# EAGLE design MxxxOVR (EAGLE 6.6.0)

## Sheet 1 of 6
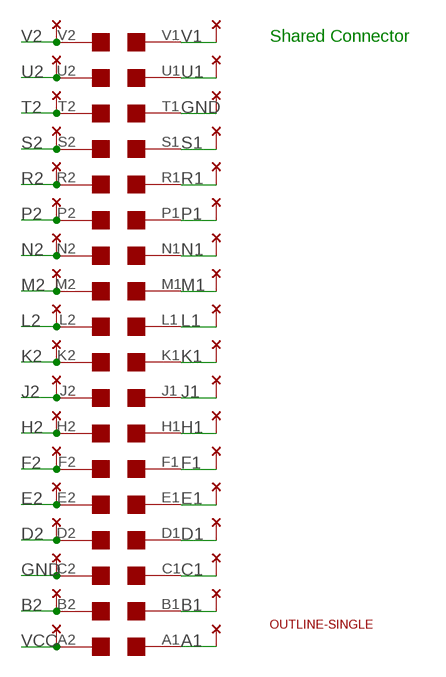
[diagram p0: schematic, sheet 1]

### Parts
U$1  EDGE-2CONNECTOR  [EDGE-CON2]
U$4  THRU-HOLE2A  [THRU-HOLEA]
U$5  OUTLINE-SINGLE  [SINGLE]

### Nets
A1: U$1.A1 U$4.A1 ; also sheet 2,3,4,5,6
B1: U$1.B1 U$4.B1 ; also sheet 2,3,4,5,6
B2: U$1.B2 U$4.B2
C1: U$1.C1 U$4.C1 ; also sheet 2,3,4,5,6
D1: U$1.D1 U$4.D1 ; also sheet 2,3,4,5,6
D2: U$1.D2 U$4.D2 ; also sheet 2,3,4,5,6
E1: U$1.E1 U$4.E1 ; also sheet 2,3,4,5
E2: U$1.E2 U$4.E2 ; also sheet 2,3,4,5,6
F1: U$1.F1 U$4.F1 ; also sheet 2,3,4,5,6
F2: U$1.F2 U$4.F2 ; also sheet 2,3,4,5,6
GND [Power]: U$1.C2 U$1.T1 U$4.C2 U$4.T1 ; also sheet 2,3,4,5,6
H1: U$1.H1 U$4.H1 ; also sheet 2,3,4,5,6
H2: U$1.H2 U$4.H2 ; also sheet 2,3,4,5,6
J1: U$1.J1 U$4.J1 ; also sheet 2,3,4,5,6
J2: U$1.J2 U$4.J2 ; also sheet 2,3,4,5,6
K1: U$1.K1 U$4.K1 ; also sheet 2,3,4,5,6
K2: U$1.K2 U$4.K2 ; also sheet 2,3,4,5,6
L1: U$1.L1 U$4.L1 ; also sheet 2,3,4,5
L2: U$1.L2 U$4.L2 ; also sheet 2,3,4,5,6
M1: U$1.M1 U$4.M1 ; also sheet 2,3,4,5,6
M2: U$1.M2 U$4.M2 ; also sheet 2,3,4,5,6
N1: U$1.N1 U$4.N1 ; also sheet 2,3,4,5,6
N2: U$1.N2 U$4.N2 ; also sheet 2,3,4,5,6
P1: U$1.P1 U$4.P1 ; also sheet 2,3,4,5,6
P2: U$1.P2 U$4.P2 ; also sheet 2,3,4,5,6
R1: U$1.R1 U$4.R1 ; also sheet 2,3,4,5,6
R2: U$1.R2 U$4.R2 ; also sheet 2,3,4,5,6
S1: U$1.S1 U$4.S1 ; also sheet 2,3,4,5
S2: U$1.S2 U$4.S2 ; also sheet 2,3,4,5,6
T2: U$1.T2 U$4.T2 ; also sheet 2,3,4,5,6
U1: U$1.U1 U$4.U1 ; also sheet 2,3,4
U2: U$1.U2 U$4.U2 ; also sheet 2,3,4,5,6
V1: U$1.V1 U$4.V1 ; also sheet 2,3,4
V2: U$1.V2 U$4.V2 ; also sheet 2,3,4,5,6
VCC [Power]: U$1.A2 U$4.A2 ; also sheet 2,3,4,5,6

### Notes on the sheet
- Shared Connector

## Sheet 2 of 6
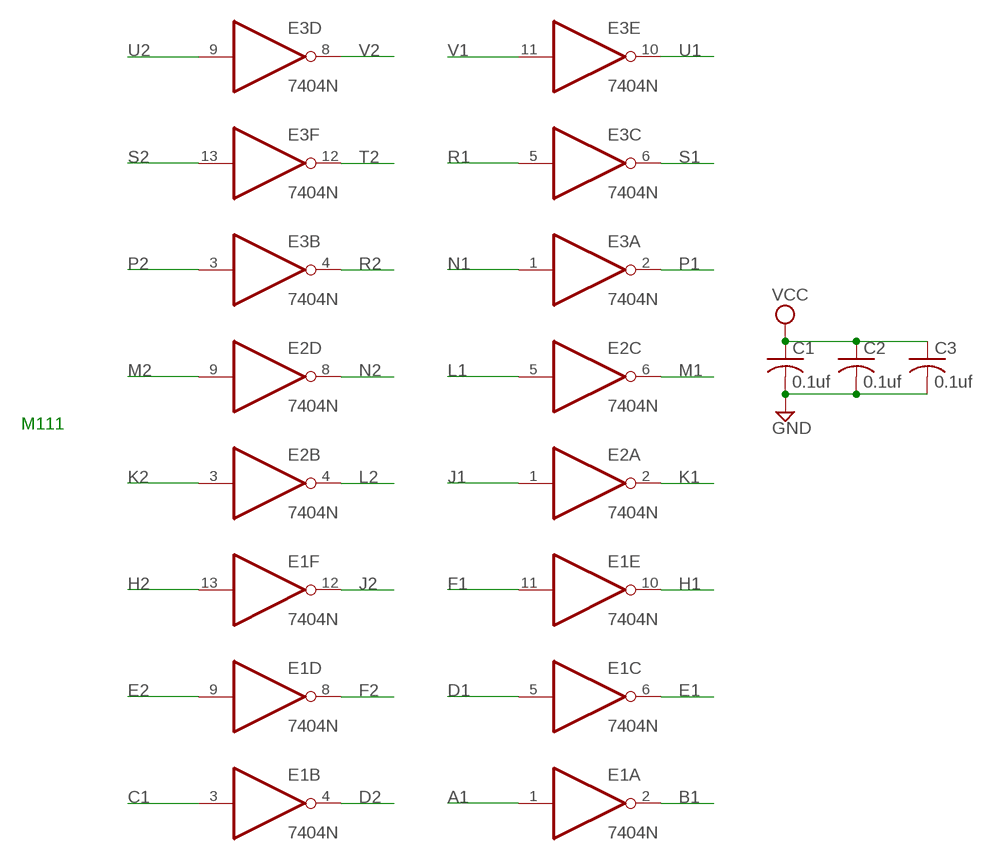
[diagram p1: schematic, sheet 2]

### Parts
C1  0.1uf  C-US050-025X075  [C050-025X075]
C2  0.1uf  C-US050-025X075  [C050-025X075]
C3  0.1uf  C-US050-025X075  [C050-025X075]
E1  7404N  [DIL14]
E2  7404N  [DIL14]
E3  7404N  [DIL14]

### Nets
A1: E1.1(A:I) ; also sheet 1,3,4,5,6
B1: E1.2(A:O) ; also sheet 1,3,4,5,6
C1: E1.3(B:I) ; also sheet 1,3,4,5,6
D1: E1.5(C:I) ; also sheet 1,3,4,5,6
D2: E1.4(B:O) ; also sheet 1,3,4,5,6
E1: E1.6(C:O) ; also sheet 1,3,4,5
E2: E1.9(D:I) ; also sheet 1,3,4,5,6
F1: E1.11(E:I) ; also sheet 1,3,4,5,6
F2: E1.8(D:O) ; also sheet 1,3,4,5,6
GND [Power]: C1.2 C2.2 C3.2 ; also sheet 1,3,4,5,6
H1: E1.10(E:O) ; also sheet 1,3,4,5,6
H2: E1.13(F:I) ; also sheet 1,3,4,5,6
J1: E2.1(A:I) ; also sheet 1,3,4,5,6
J2: E1.12(F:O) ; also sheet 1,3,4,5,6
K1: E2.2(A:O) ; also sheet 1,3,4,5,6
K2: E2.3(B:I) ; also sheet 1,3,4,5,6
L1: E2.5(C:I) ; also sheet 1,3,4,5
L2: E2.4(B:O) ; also sheet 1,3,4,5,6
M1: E2.6(C:O) ; also sheet 1,3,4,5,6
M2: E2.9(D:I) ; also sheet 1,3,4,5,6
N1: E3.1(A:I) ; also sheet 1,3,4,5,6
N2: E2.8(D:O) ; also sheet 1,3,4,5,6
P1: E3.2(A:O) ; also sheet 1,3,4,5,6
P2: E3.3(B:I) ; also sheet 1,3,4,5,6
R1: E3.5(C:I) ; also sheet 1,3,4,5,6
R2: E3.4(B:O) ; also sheet 1,3,4,5,6
S1: E3.6(C:O) ; also sheet 1,3,4,5
S2: E3.13(F:I) ; also sheet 1,3,4,5,6
T2: E3.12(F:O) ; also sheet 1,3,4,5,6
U1: E3.10(E:O) ; also sheet 1,3,4
U2: E3.9(D:I) ; also sheet 1,3,4,5,6
V1: E3.11(E:I) ; also sheet 1,3,4
V2: E3.8(D:O) ; also sheet 1,3,4,5,6
VCC [Power]: C1.1 C2.1 C3.1 ; also sheet 1,3,4,5,6
Unconnected: E2.10(E:O) E2.11(E:I) E2.12(F:O) E2.13(F:I)

### Notes on the sheet
- M111

## Sheet 3 of 6
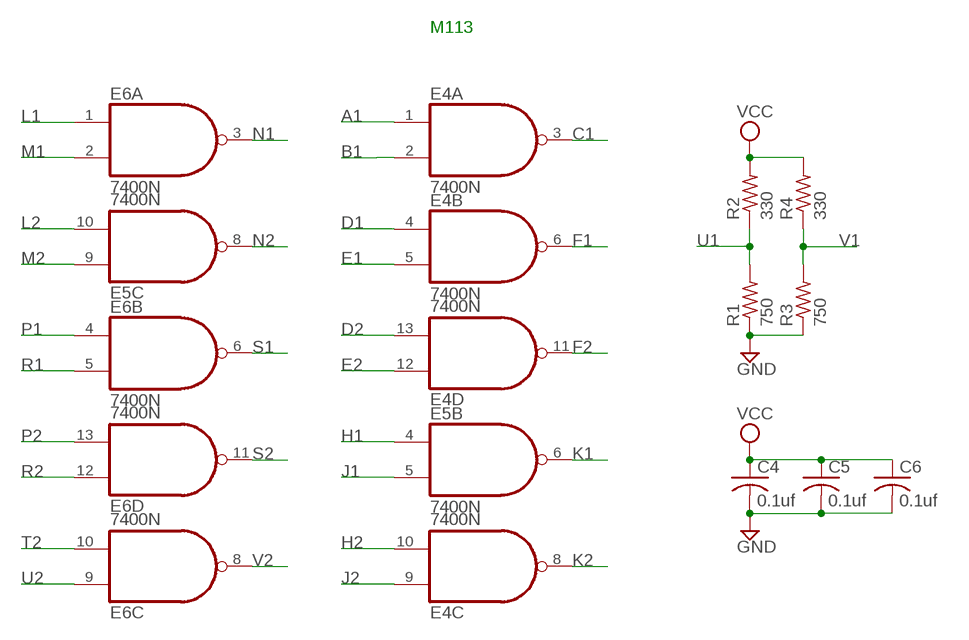
[diagram p2: schematic, sheet 3]

### Parts
C4  0.1uf  C-US050-025X075  [C050-025X075]
C5  0.1uf  C-US050-025X075  [C050-025X075]
C6  0.1uf  C-US050-025X075  [C050-025X075]
E4  7400N  [DIL14]
E5  7400N  [DIL14]
E6  7400N  [DIL14]
R1  750  R-US_0207/10  [0207/10]
R2  330  R-US_0207/10  [0207/10]
R3  750  R-US_0207/10  [0207/10]
R4  330  R-US_0207/10  [0207/10]

### Nets
A1: E4.1(A:I0) ; also sheet 1,2,4,5,6
B1: E4.2(A:I1) ; also sheet 1,2,4,5,6
C1: E4.3(A:O) ; also sheet 1,2,4,5,6
D1: E4.4(B:I0) ; also sheet 1,2,4,5,6
D2: E4.13(D:I1) ; also sheet 1,2,4,5,6
E1: E4.5(B:I1) ; also sheet 1,2,4,5
E2: E4.12(D:I0) ; also sheet 1,2,4,5,6
F1: E4.6(B:O) ; also sheet 1,2,4,5,6
F2: E4.11(D:O) ; also sheet 1,2,4,5,6
GND [Power]: C4.2 C5.2 C6.2 R1.1 R3.1 ; also sheet 1,2,4,5,6
H1: E5.4(B:I0) ; also sheet 1,2,4,5,6
H2: E4.10(C:I1) ; also sheet 1,2,4,5,6
J1: E5.5(B:I1) ; also sheet 1,2,4,5,6
J2: E4.9(C:I0) ; also sheet 1,2,4,5,6
K1: E5.6(B:O) ; also sheet 1,2,4,5,6
K2: E4.8(C:O) ; also sheet 1,2,4,5,6
L1: E6.1(A:I0) ; also sheet 1,2,4,5
L2: E5.10(C:I1) ; also sheet 1,2,4,5,6
M1: E6.2(A:I1) ; also sheet 1,2,4,5,6
M2: E5.9(C:I0) ; also sheet 1,2,4,5,6
N1: E6.3(A:O) ; also sheet 1,2,4,5,6
N2: E5.8(C:O) ; also sheet 1,2,4,5,6
P1: E6.4(B:I0) ; also sheet 1,2,4,5,6
P2: E6.13(D:I1) ; also sheet 1,2,4,5,6
R1: E6.5(B:I1) ; also sheet 1,2,4,5,6
R2: E6.12(D:I0) ; also sheet 1,2,4,5,6
S1: E6.6(B:O) ; also sheet 1,2,4,5
S2: E6.11(D:O) ; also sheet 1,2,4,5,6
T2: E6.10(C:I1) ; also sheet 1,2,4,5,6
U1: R1.2 R2.1 ; also sheet 1,2,4
U2: E6.9(C:I0) ; also sheet 1,2,4,5,6
V1: R3.2 R4.1 ; also sheet 1,2,4
V2: E6.8(C:O) ; also sheet 1,2,4,5,6
VCC [Power]: C4.1 C5.1 C6.1 R2.2 R4.2 ; also sheet 1,2,4,5,6
Unconnected: E5.1(A:I0) E5.2(A:I1) E5.3(A:O) E5.11(D:O) E5.12(D:I0) E5.13(D:I1)

### Notes on the sheet
- M113

## Sheet 4 of 6
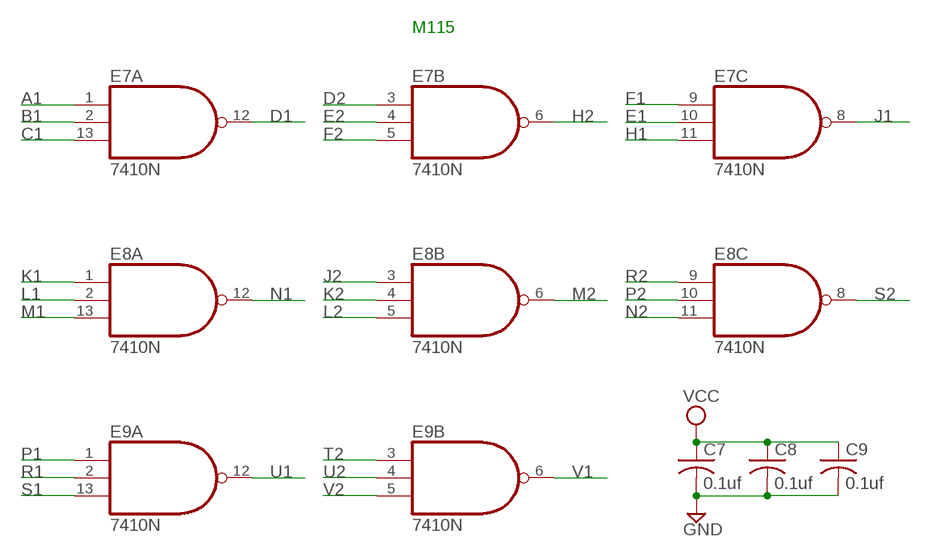
[diagram p3: schematic, sheet 4]

### Parts
C7  0.1uf  C-US050-025X075  [C050-025X075]
C8  0.1uf  C-US050-025X075  [C050-025X075]
C9  0.1uf  C-US050-025X075  [C050-025X075]
E7  7410N  [DIL14]
E8  7410N  [DIL14]
E9  7410N  [DIL14]

### Nets
A1: E7.1(A:I0) ; also sheet 1,2,3,5,6
B1: E7.2(A:I1) ; also sheet 1,2,3,5,6
C1: E7.13(A:I2) ; also sheet 1,2,3,5,6
D1: E7.12(A:O) ; also sheet 1,2,3,5,6
D2: E7.3(B:I0) ; also sheet 1,2,3,5,6
E1: E7.10(C:I1) ; also sheet 1,2,3,5
E2: E7.4(B:I1) ; also sheet 1,2,3,5,6
F1: E7.9(C:I0) ; also sheet 1,2,3,5,6
F2: E7.5(B:I2) ; also sheet 1,2,3,5,6
GND [Power]: C7.2 C8.2 C9.2 ; also sheet 1,2,3,5,6
H1: E7.11(C:I2) ; also sheet 1,2,3,5,6
H2: E7.6(B:O) ; also sheet 1,2,3,5,6
J1: E7.8(C:O) ; also sheet 1,2,3,5,6
J2: E8.3(B:I0) ; also sheet 1,2,3,5,6
K1: E8.1(A:I0) ; also sheet 1,2,3,5,6
K2: E8.4(B:I1) ; also sheet 1,2,3,5,6
L1: E8.2(A:I1) ; also sheet 1,2,3,5
L2: E8.5(B:I2) ; also sheet 1,2,3,5,6
M1: E8.13(A:I2) ; also sheet 1,2,3,5,6
M2: E8.6(B:O) ; also sheet 1,2,3,5,6
N1: E8.12(A:O) ; also sheet 1,2,3,5,6
N2: E8.11(C:I2) ; also sheet 1,2,3,5,6
P1: E9.1(A:I0) ; also sheet 1,2,3,5,6
P2: E8.10(C:I1) ; also sheet 1,2,3,5,6
R1: E9.2(A:I1) ; also sheet 1,2,3,5,6
R2: E8.9(C:I0) ; also sheet 1,2,3,5,6
S1: E9.13(A:I2) ; also sheet 1,2,3,5
S2: E8.8(C:O) ; also sheet 1,2,3,5,6
T2: E9.3(B:I0) ; also sheet 1,2,3,5,6
U1: E9.12(A:O) ; also sheet 1,2,3
U2: E9.4(B:I1) ; also sheet 1,2,3,5,6
V1: E9.6(B:O) ; also sheet 1,2,3
V2: E9.5(B:I2) ; also sheet 1,2,3,5,6
VCC [Power]: C7.1 C8.1 C9.1 ; also sheet 1,2,3,5,6
Unconnected: E9.8(C:O) E9.9(C:I0) E9.10(C:I1) E9.11(C:I2)

### Notes on the sheet
- M115

## Sheet 5 of 6
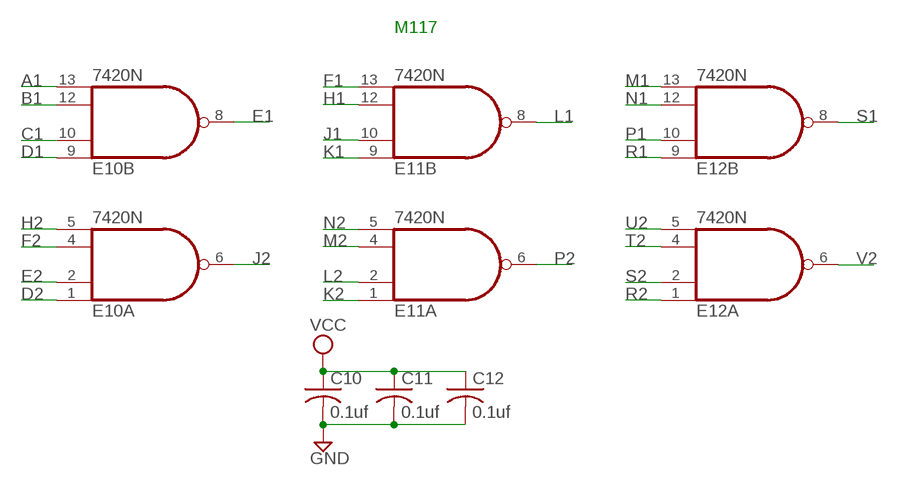
[diagram p4: schematic, sheet 5]

### Parts
C10  0.1uf  C-US050-025X075  [C050-025X075]
C11  0.1uf  C-US050-025X075  [C050-025X075]
C12  0.1uf  C-US050-025X075  [C050-025X075]
E10  7420N  74S20N  [DIL14]
E11  7420N  74S20N  [DIL14]
E12  7420N  74S20N  [DIL14]

### Nets
A1: E10.13(B:I3) ; also sheet 1,2,3,4,6
B1: E10.12(B:I2) ; also sheet 1,2,3,4,6
C1: E10.10(B:I1) ; also sheet 1,2,3,4,6
D1: E10.9(B:I0) ; also sheet 1,2,3,4,6
D2: E10.1(A:I0) ; also sheet 1,2,3,4,6
E1: E10.8(B:O) ; also sheet 1,2,3,4
E2: E10.2(A:I1) ; also sheet 1,2,3,4,6
F1: E11.13(B:I3) ; also sheet 1,2,3,4,6
F2: E10.4(A:I2) ; also sheet 1,2,3,4,6
GND [Power]: C10.2 C11.2 C12.2 ; also sheet 1,2,3,4,6
H1: E11.12(B:I2) ; also sheet 1,2,3,4,6
H2: E10.5(A:I3) ; also sheet 1,2,3,4,6
J1: E11.10(B:I1) ; also sheet 1,2,3,4,6
J2: E10.6(A:O) ; also sheet 1,2,3,4,6
K1: E11.9(B:I0) ; also sheet 1,2,3,4,6
K2: E11.1(A:I0) ; also sheet 1,2,3,4,6
L1: E11.8(B:O) ; also sheet 1,2,3,4
L2: E11.2(A:I1) ; also sheet 1,2,3,4,6
M1: E12.13(B:I3) ; also sheet 1,2,3,4,6
M2: E11.4(A:I2) ; also sheet 1,2,3,4,6
N1: E12.12(B:I2) ; also sheet 1,2,3,4,6
N2: E11.5(A:I3) ; also sheet 1,2,3,4,6
P1: E12.10(B:I1) ; also sheet 1,2,3,4,6
P2: E11.6(A:O) ; also sheet 1,2,3,4,6
R1: E12.9(B:I0) ; also sheet 1,2,3,4,6
R2: E12.1(A:I0) ; also sheet 1,2,3,4,6
S1: E12.8(B:O) ; also sheet 1,2,3,4
S2: E12.2(A:I1) ; also sheet 1,2,3,4,6
T2: E12.4(A:I2) ; also sheet 1,2,3,4,6
U2: E12.5(A:I3) ; also sheet 1,2,3,4,6
V2: E12.6(A:O) ; also sheet 1,2,3,4,6
VCC [Power]: C10.1 C11.1 C12.1 ; also sheet 1,2,3,4,6

### Notes on the sheet
- M117

## Sheet 6 of 6
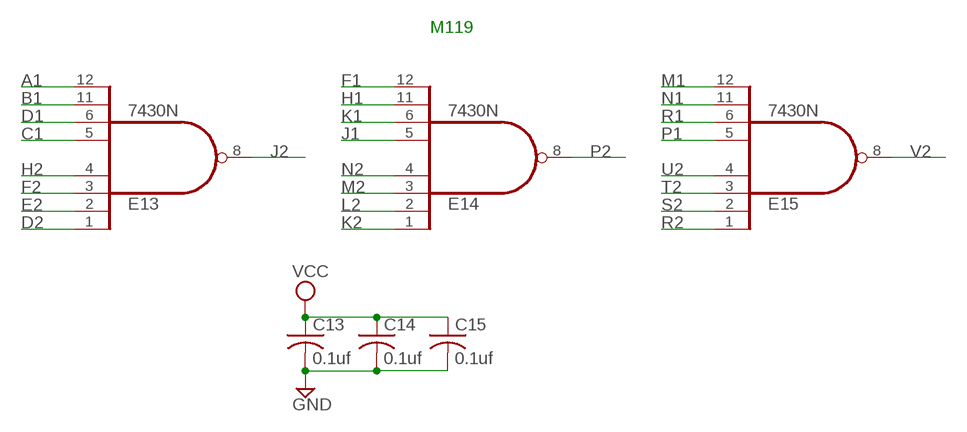
[diagram p5: schematic, sheet 6]

### Parts
C13  0.1uf  C-US050-025X075  [C050-025X075]
C14  0.1uf  C-US050-025X075  [C050-025X075]
C15  0.1uf  C-US050-025X075  [C050-025X075]
E13  7430N  [DIL14]
E14  7430N  [DIL14]
E15  7430N  [DIL14]

### Nets
A1: E13.12(I7) ; also sheet 1,2,3,4,5
B1: E13.11(I6) ; also sheet 1,2,3,4,5
C1: E13.5(I4) ; also sheet 1,2,3,4,5
D1: E13.6(I5) ; also sheet 1,2,3,4,5
D2: E13.1(I0) ; also sheet 1,2,3,4,5
E2: E13.2(I1) ; also sheet 1,2,3,4,5
F1: E14.12(I7) ; also sheet 1,2,3,4,5
F2: E13.3(I2) ; also sheet 1,2,3,4,5
GND [Power]: C13.2 C14.2 C15.2 ; also sheet 1,2,3,4,5
H1: E14.11(I6) ; also sheet 1,2,3,4,5
H2: E13.4(I3) ; also sheet 1,2,3,4,5
J1: E14.5(I4) ; also sheet 1,2,3,4,5
J2: E13.8(O) ; also sheet 1,2,3,4,5
K1: E14.6(I5) ; also sheet 1,2,3,4,5
K2: E14.1(I0) ; also sheet 1,2,3,4,5
L2: E14.2(I1) ; also sheet 1,2,3,4,5
M1: E15.12(I7) ; also sheet 1,2,3,4,5
M2: E14.3(I2) ; also sheet 1,2,3,4,5
N1: E15.11(I6) ; also sheet 1,2,3,4,5
N2: E14.4(I3) ; also sheet 1,2,3,4,5
P1: E15.5(I4) ; also sheet 1,2,3,4,5
P2: E14.8(O) ; also sheet 1,2,3,4,5
R1: E15.6(I5) ; also sheet 1,2,3,4,5
R2: E15.1(I0) ; also sheet 1,2,3,4,5
S2: E15.2(I1) ; also sheet 1,2,3,4,5
T2: E15.3(I2) ; also sheet 1,2,3,4,5
U2: E15.4(I3) ; also sheet 1,2,3,4,5
V2: E15.8(O) ; also sheet 1,2,3,4,5
VCC [Power]: C13.1 C14.1 C15.1 ; also sheet 1,2,3,4,5

### Notes on the sheet
- M119

## Power pins joined to a net without a drawn wire
GND: E1.7(P:GND) E2.7(P:GND) E3.7(P:GND) E4.7(P:GND) E5.7(P:GND) E6.7(P:GND) E7.7(P:GND) E8.7(P:GND) E9.7(P:GND) E10.7(P:GND) E11.7(P:GND) E12.7(P:GND) E13.7(GND) E14.7(GND) E15.7(GND)
VCC: E1.14(P:VCC) E2.14(P:VCC) E3.14(P:VCC) E4.14(P:VCC) E5.14(P:VCC) E6.14(P:VCC) E7.14(P:VCC) E8.14(P:VCC) E9.14(P:VCC) E10.14(P:VCC) E11.14(P:VCC) E12.14(P:VCC) E13.14(VCC) E14.14(VCC) E15.14(VCC)

## Library data of the parts
C1-C15 = rcl:C-US: CAPACITOR, American symbol
E1-E3 = 74xx-us:74*04: Hex INVERTER
E4-E6 = 74xx-us:74*00: Quad 2-input NAND gate
E7-E9 = 74xx-us:74*10: Triple 3-input NAND gate
E10-E12 = 74xx-us:74*20: Dual 4-input NAND gate
E13-E15 = 74xx-us:74*30: 8-input NAND gate
R1-R4 = rcl:R-US_: RESISTOR, American symbol
U$1 = dec-con:EDGE-2: Double-Sided DEC edge connector.
U$4 = dec-con:THRU-HOLE2: Thru-Hole addition to double-sided edge connector.
U$5 = dec-con:OUTLINE-*: Board outlines for DEC boards.

## Net classes
1 Power: width 0.381 mm

## Board
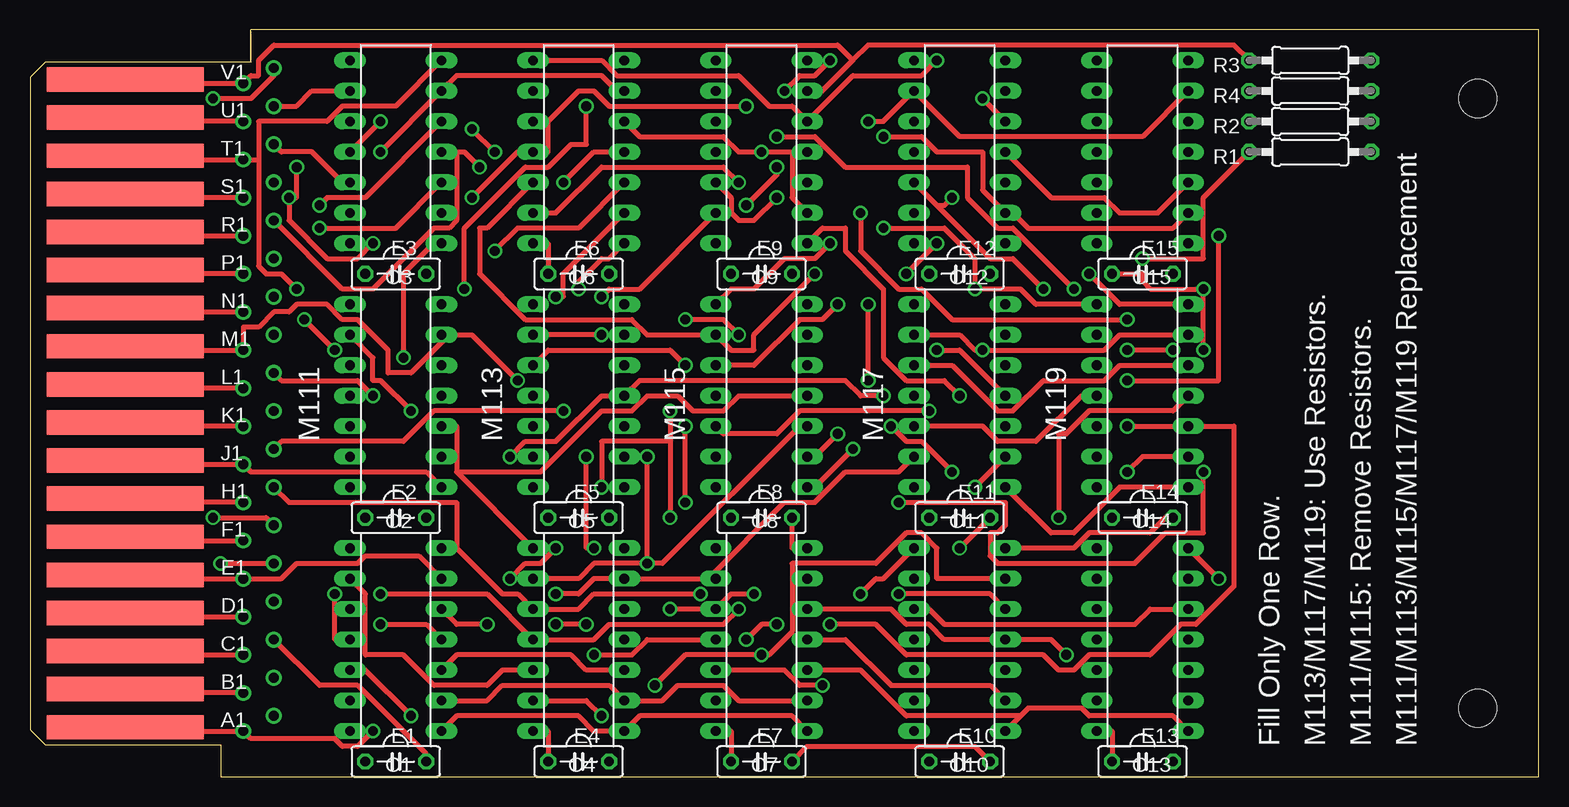
[diagram p6: board, top side]
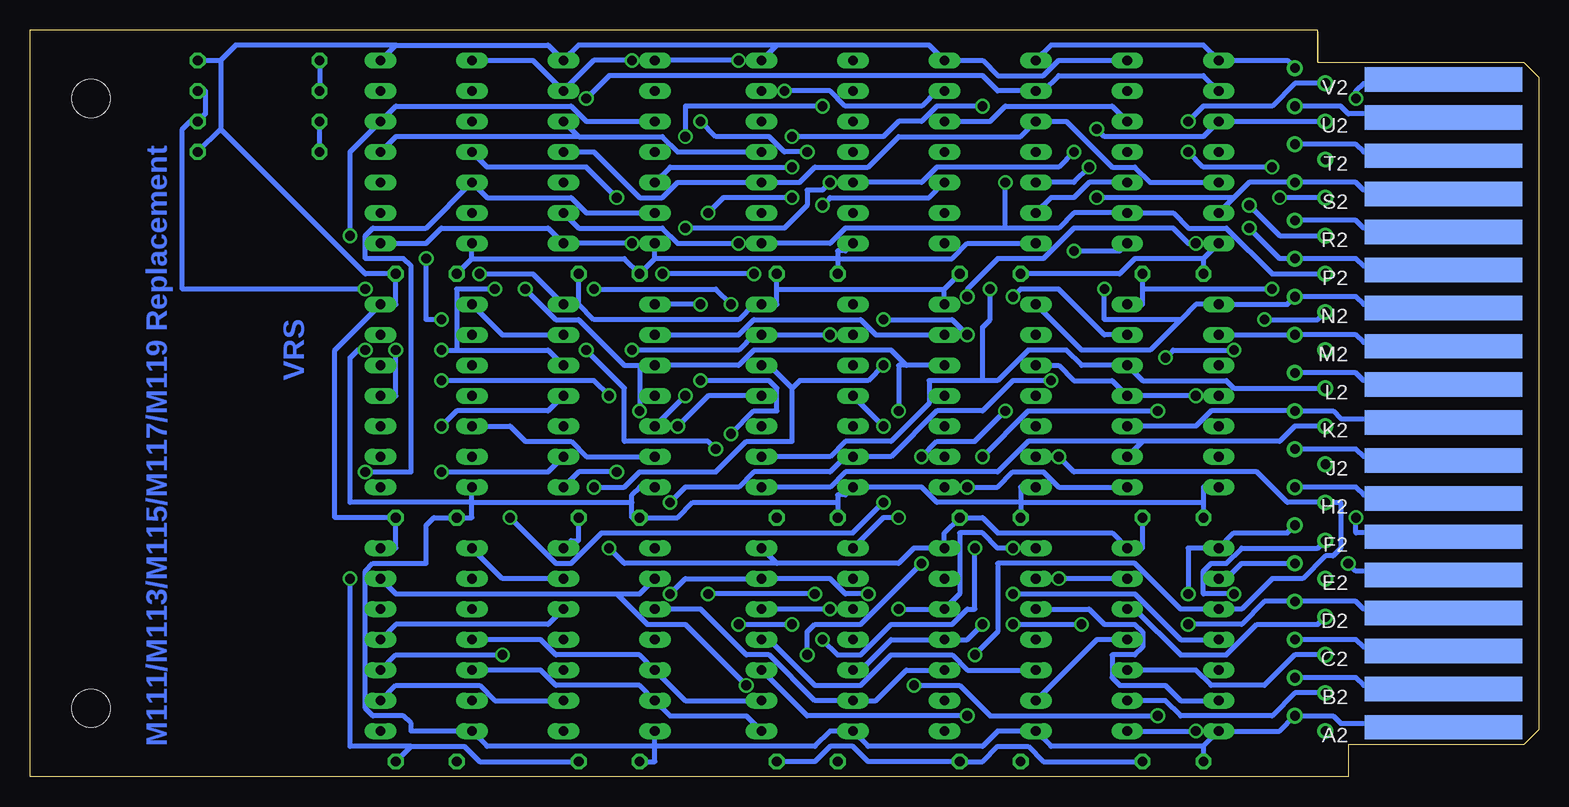
[diagram p7: board, bottom side, seen from below]

Size 125.73 x 62.23 mm. Coordinates in mm from the lower left corner, seen from the top.
Copper layers (1+16): Top 0.035mm / dielectric 1.5mm / Bottom 0.035mm
Design rules "16mils": minimum track width 16mil, minimum drill 32mil, track to track 15mil, track to pad 10mil, pad to pad 10mil, via to via 10mil, smd to smd 10mil, copper to edge 13mil, drill to drill 10mil, minimum pad ring 10mil, minimum via ring 8mil, stop-mask expansion 0mil, vias tented up to drill 0mil, thermal gap 10mil

### Footprints (pad centres in the part's own frame; a part is rotated, then mirrored left to right if it is on the bottom)
C050-025X075 = drill 0.813 octagon: 1 -2.54,0; 2 2.54,0
DIL14 = drill 0.813 long: 1 -7.62,-3.81; 2 -5.08,-3.81; 3 -2.54,-3.81; 4 0,-3.81; 5 2.54,-3.81; 6 5.08,-3.81; 7 7.62,-3.81; 8 7.62,3.81; 9 5.08,3.81; 10 2.54,3.81; 11 0,3.81; 12 -2.54,3.81; 13 -5.08,3.81; 14 -7.62,3.81
0207/10 = drill 0.813 octagon: 1 -5.08,0; 2 5.08,0
EDGE-CON2 = smd 13.106 x 2.032: A1 7.938,4.128; B1 7.938,7.303; C1 7.938,10.477; D1 7.938,13.652; E1 7.938,16.828; F1 7.938,20.003; H1 7.938,23.177; J1 7.938,26.352; K1 7.938,29.527; L1 7.938,32.703; M1 7.938,35.877; N1 7.938,39.053; P1 7.938,42.227; R1 7.938,45.403; S1 7.938,48.578; T1 7.938,51.752; U1 7.938,54.928; V1 7.938,58.102 | smd 13.106 x 2.032 bottom: A2 7.938,4.128; B2 7.938,7.303; C2 7.938,10.477; D2 7.938,13.652; E2 7.938,16.828; F2 7.938,20.003; H2 7.938,23.177; J2 7.938,26.352; K2 7.938,29.527; L2 7.938,32.703; M2 7.938,35.877; N2 7.938,39.053; P2 7.938,42.227; R2 7.938,45.403; S2 7.938,48.578; T2 7.938,51.752; U2 7.938,54.928; V2 7.938,58.102
THRU-HOLEA = drill 0.813 pad 1.27: A1 17.78,3.81; A2 20.32,5.08; B1 17.78,6.985; B2 20.32,8.255; C1 17.78,10.16; C2 20.32,11.43; D1 17.78,13.335; D2 20.32,14.605; E1 17.78,16.51; E2 20.32,17.78; F1 17.78,19.685; F2 20.32,20.955; H1 17.78,22.86; H2 20.32,24.13; J1 17.78,26.035; J2 20.32,27.305; K1 17.78,29.21; K2 20.32,30.48; L1 17.78,32.385; L2 20.32,33.655; M1 17.78,35.56; M2 20.32,36.83; N1 17.78,38.735; N2 20.32,40.005; P1 17.78,41.91; P2 20.32,43.18; R1 17.78,45.085; R2 20.32,46.355; S1 17.78,48.26; S2 20.32,49.53; T1 17.78,51.435; T2 20.32,52.705; U1 17.78,54.61; U2 20.32,55.88; V1 17.78,57.785; V2 20.32,59.055
SINGLE = hole 3.175: 120.65,56.515; 120.65,5.715

### Placement (x,y rotation side)
C1  30.48,1.27 0 top
C2  30.48,21.59 0 top
C3  30.48,41.91 0 top
C4  45.72,1.27 0 top
C5  45.72,21.59 0 top
C6  45.72,41.91 0 top
C7  60.96,1.27 0 top
C8  60.96,21.59 0 top
C9  60.96,41.91 0 top
C10  77.47,1.27 0 top
C11  77.47,21.59 0 top
C12  77.47,41.91 0 top
C13  92.71,1.27 0 top
C14  92.71,21.59 0 top
C15  92.71,41.91 0 top
E1  30.48,11.43 90 top
E2  30.48,31.75 90 top
E3  30.48,52.07 90 top
E4  45.72,11.43 90 top
E5  45.72,31.75 90 top
E6  45.72,52.07 90 top
E7  60.96,11.43 90 top
E8  60.96,31.75 90 top
E9  60.96,52.07 90 top
E10  77.47,11.43 90 top
E11  77.47,31.75 90 top
E12  77.47,52.07 90 top
E13  92.71,11.43 90 top
E14  92.71,31.75 90 top
E15  92.71,52.07 90 top
R1  106.68,52.07 180 top
R2  106.68,54.61 0 top
R3  106.68,59.69 180 top
R4  106.68,57.15 0 top
U$1  0,0 0 top
U$4  0,0 0 top
U$5  0,0 0 top

### Tracks (layer width: path | path; a pad name or v marks a point on that pad's centre or on a via)
A1  (via drill 0.81)
  Top 0.406: U$1.A1 8.26,3.81 U$4.A1 18.42,3.17 25.4,3.17 26.04,2.54 27.31,2.54 v28.58,3.81 | E1.1 35.56,5.08 45.72,5.08 46.99,3.81 E4.1 50.8,5.08 63.5,5.08 E7.1
  Bottom 0.406: E7.1 66.04,5.08 72.39,5.08 E10.13 74.93,7.62 81.92,7.62 83.19,8.89 E13.12 | E1.1 v28.58,3.81
B1
  Top 0.406: E1.2 38.1,6.35 39.37,7.62 48.26,7.62 E4.2 52.71,6.35 53.98,7.62 57.79,7.62 59.06,6.35 E7.2 | U$4.B1 8.26,6.99 U$1.B1
  Bottom 0.406: E7.2 71.12,6.35 E10.12 74.93,10.16 81.92,10.16 83.19,11.43 E13.11 | E1.2 31.12,6.35 29.85,5.08 22.23,5.08 20.32,6.99 U$4.B1
B2
  Bottom 0.406: U$4.B2 15.24,8.26 14.61,7.62 8.26,7.62 U$1.B2
C1
  Top 0.406: U$4.C1 8.26,10.16 U$1.C1 | E13.5 93.35,13.97 92.08,12.7 76.2,12.7 74.93,13.97 E10.10 | E1.3 35.56,10.16 45.09,10.16 46.36,8.89 E4.3
  Bottom 0.406: E1.3 28.58,8.89 27.31,7.62 22.86,7.62 20.32,10.16 U$4.C1 | E4.3 52.71,8.89 55.25,6.35 E7.13 60.33,6.35 64.14,10.16 66.04,10.16 69.85,13.97 E10.10
D1  (via drill 0.81)
  Top 0.406: U$4.D1 8.26,13.34 U$1.D1 | E7.12 62.87,8.89 64.14,7.62 v66.04,7.62 | E1.5 35.56,12.7 v38.1,12.7 | v46.36,12.7 v43.82,12.7
  Bottom 0.406: U$4.D1 18.42,12.7 23.5,12.7 26.04,10.16 29.85,10.16 33.66,13.97 E1.5 | E7.12 56.52,8.89 53.98,11.43 E4.4 47.63,11.43 v46.36,12.7 | E10.9 74.93,15.24 76.84,15.24 | 76.84,15.24 95.25,15.24 E13.6 | v66.04,7.62 71.12,12.7 74.3,12.7 76.84,15.24 | v43.82,12.7 v38.1,12.7
D2  (via drill 0.81)
  Top 0.406: 82.55,5.08 83.19,5.71 87.63,5.71 88.27,5.08 95.25,5.08 E13.1 | 82.55,5.08 E10.1 | E7.3 69.22,8.89 73.03,5.08 82.55,5.08 | E1.4 33.02,12.7 v29.21,12.7 | v47.63,5.08 46.36,6.35 E4.13
  Bottom 0.406: E4.13 36.83,11.43 E1.4 | U$1.D2 8.26,13.97 14.61,13.97 15.24,14.61 U$4.D2 22.86,14.61 24.77,12.7 v29.21,12.7 | E7.3 60.96,5.08 v47.63,5.08
E1  (via drill 0.81)
  Top 0.406: v53.34,13.97 E7.10 58.42,15.24 v60.33,15.24 | E10.8 71.12,16.51 70.49,16.51 v69.22,15.24 | U$1.E1 8.26,16.51 U$4.E1 20.96,16.51 22.23,17.78 27.31,17.78 27.94,18.41 32.39,18.41 E1.6 | v43.82,19.05 42.55,17.78 41.28,17.78 v40.01,16.51
  Bottom 0.406: v53.34,13.97 E4.5 48.26,15.24 48.26,20.32 46.36,20.32 45.09,19.05 v43.82,19.05 | v60.33,15.24 v69.22,15.24 | E1.6 v40.01,16.51
E2  (via drill 0.81)
  Top 0.406: v15.88,17.78 U$4.E2 | E10.2 80.01,7.62 71.76,7.62 67.95,11.43 E7.4 | E1.9 27.94,15.24 27.94,10.16 31.12,10.16 33.66,7.62 38.1,7.62 39.37,8.89 E4.12
  Bottom 0.406: U$4.E2 24.77,17.78 26.04,16.51 E1.9 | v15.88,17.78 15.24,17.14 8.26,17.14 U$1.E2 | E10.2 87,6.35 88.27,7.62 95.25,7.62 E13.2 | E4.12 47.63,8.89 48.9,10.16 53.98,10.16 56.52,7.62 60.33,7.62 64.14,11.43 E7.4
F1  (via drill 0.81)
  Top 0.406: U$4.F1 8.26,19.68 U$1.F1 | v43.82,15.24 45.72,15.24 46.99,16.51 E4.6 56.52,16.51 | E11.13 72.39,25.4 67.95,25.4 65.41,22.86 62.87,22.86 56.52,16.51 | 56.52,16.51 E7.9 | v25.4,15.24 25.4,11.43 E1.11
  Bottom 0.406: E11.13 79.38,26.67 80.65,27.94 84.46,27.94 85.73,29.21 E14.12 | E1.11 29.85,11.43 33.66,15.24 v43.82,15.24 | U$4.F1 18.42,19.05 24.77,19.05 26.04,17.78 27.31,17.78 27.94,17.14 27.94,15.24 v25.4,15.24
F2  (via drill 0.81)
  Top 0.406: v86.36,10.16 85.09,11.43 E10.4 76.2,11.43 74.93,12.7 73.03,12.7 71.76,13.97 E7.5 | v29.21,15.24 38.1,15.24 E4.11 46.99,11.43 48.26,12.7 57.79,12.7 v59.06,13.97 | U$4.F2 19.69,21.59 v15.24,21.59
  Bottom 0.406: v86.36,10.16 95.25,10.16 E13.3 | v29.21,15.24 29.21,19.05 E1.8 25.4,20.32 20.96,20.32 U$4.F2 | v15.24,21.59 15.24,20.32 8.26,20.32 U$1.F2 | v59.06,13.97 E7.5
GND  (via drill 0.81)
  Top 0.406: E10.7 87,19.05 88.27,20.32 93.35,20.32 94.62,21.59 C14.2 | C8.2 63.5,19.05 E7.7 | v77.47,19.05 C11.2 | C10.2 78.74,2.54 64.77,2.54 C7.2 | U$4.C2 24.13,7.62 27.31,7.62 33.02,1.91 C1.2 | v99.06,16.51 E13.7 | U$1.T1 8.26,51.44 U$4.T1 19.05,51.44 | v22.23,40.64 20.96,41.91 19.69,41.91 19.05,42.55 19.05,51.44 | v88.27,41.91 90.81,39.37 E14.7 | 19.05,51.44 19.05,54.61 24.77,54.61 26.04,55.88 30.48,55.88 E3.7
  Bottom 0.406: C11.2 80.01,19.68 80.65,19.68 E10.7 | E13.7 95.25,19.05 C14.2 100.33,21.59 100.33,35.56 E14.7 95.25,39.37 C15.2 97.79,41.91 109.86,53.98 | C2.2 33.02,19.05 E1.7 35.56,20.32 45.09,20.32 46.36,21.59 C5.2 49.53,20.32 E4.7 52.07,19.05 53.34,17.78 63.5,17.78 | 63.5,17.78 E7.7 | v77.47,19.05 76.2,17.78 63.5,17.78 | U$4.C2 15.24,11.43 14.61,10.79 8.26,10.79 U$1.C2 | C10.2 88.27,1.27 89.54,2.54 93.98,2.54 | C13.2 93.98,2.54 | C1.2 41.28,1.27 42.55,2.54 45.09,2.54 46.36,1.27 C4.2 55.88,1.27 57.15,2.54 59.06,2.54 60.33,1.27 C7.2 | v99.06,16.51 99.06,2.54 93.98,2.54 | 33.02,40.64 33.02,39.37 E2.7 | 33.02,40.64 C3.2 | v22.23,40.64 33.02,40.64 | E3.7 40.01,59.69 41.28,58.42 45.09,58.42 46.36,59.69 E6.7 50.8,60.96 63.5,60.96 | 63.5,60.96 E9.7 | 63.5,60.96 80.01,60.96 E12.7 82.55,60.96 95.25,60.96 | 80.01,39.37 C12.2 | 80.01,39.37 E11.7 83.82,41.91 v88.27,41.91 | 49.53,40.64 C6.2 | E5.7 49.53,40.64 | 63.5,40.64 63.5,39.37 E8.7 65.41,39.37 66.68,38.1 78.74,38.1 80.01,39.37 | 63.5,40.64 C9.2 | 63.5,40.64 49.53,40.64 | E15.7 95.25,60.96 | 109.86,53.98 R1.1 | 109.86,59.69 109.86,53.98 | R3.1 109.86,59.69 | 109.86,59.69 108.59,60.96 95.25,60.96
H1  (via drill 0.81)
  Top 0.406: E11.12 79.38,29.21 80.65,27.94 83.82,27.94 87.63,31.75 E14.11 | v71.12,31.75 69.22,31.75 67.95,33.02 50.8,33.02 E5.4 47.63,31.75 43.82,27.94 41.28,27.94 v40.01,26.67 | E7.11 51.44,11.43 50.17,10.16 v46.99,10.16 | U$4.H1 8.26,22.86 U$1.H1
  Bottom 0.406: E11.12 v71.12,31.75 | v46.99,10.16 45.09,12.06 45.09,17.78 33.66,17.78 29.85,13.97 E1.10 24.77,13.97 22.23,16.51 19.69,16.51 17.78,18.41 17.15,18.41 16.51,19.05 16.51,22.86 U$4.H1 20.96,22.86 23.5,25.4 38.74,25.4 v40.01,26.67
H2  (via drill 0.81)
  Top 0.406: v72.39,15.24 80.01,15.24 E10.5 | U$4.H2 21.59,22.86 35.56,22.86 35.56,19.05 39.37,15.24 40.64,15.24 E4.10 45.72,13.97 46.99,15.24 v55.88,15.24
  Bottom 0.406: E13.4 95.25,12.7 82.55,12.7 E10.5 | v72.39,15.24 71.12,16.51 E7.6 59.06,16.51 57.79,15.24 v55.88,15.24 | E1.13 29.85,6.35 31.12,7.62 34.93,7.62 35.56,8.26 35.56,10.16 33.66,10.16 33.02,10.79 33.02,12.06 33.66,12.7 36.2,12.7 37.47,13.97 E4.10 | U$4.H2 15.24,24.13 14.61,23.5 8.26,23.5 U$1.H2
J1  (via drill 0.81)
  Top 0.406: E2.1 33.02,25.4 18.42,25.4 U$4.J1 8.26,26.04 U$1.J1 | v53.34,30.48 53.34,27.94 | 53.34,27.94 v53.34,21.59 | E14.5 90.81,34.29 89.54,33.02 84.46,33.02 81.92,30.48 80.65,30.48 76.84,34.29 E11.10 | v47.63,24.13 47.63,27.94 53.34,27.94
  Bottom 0.406: E7.8 54.61,21.59 v53.34,21.59 | v53.34,30.48 53.34,34.29 52.71,34.29 | E5.5 52.71,34.29 | E11.10 66.68,34.29 65.41,35.56 53.98,35.56 52.71,34.29 | E2.1 40.01,24.13 41.28,25.4 43.82,25.4 45.09,24.13 v47.63,24.13
J2  (via drill 0.81)
  Top 0.406: E4.9 45.72,16.51 46.99,17.78 v51.44,17.78 | v51.44,17.78 52.71,17.78 64.14,29.21 E8.3 | E1.12 27.94,8.89 v31.75,5.08 | v52.07,7.62 54.61,10.16 v60.96,10.16 61.6,10.16 63.5,12.06 63.5,17.78 70.49,17.78 73.03,20.32 74.3,20.32 75.57,19.05 75.57,16.51 E10.6 | U$4.J2 20.96,27.94 31.12,27.94 33.66,30.48 v44.45,30.48 | v51.44,17.78 v51.44,26.67
  Bottom 0.406: U$4.J2 15.24,27.3 14.61,26.67 8.26,26.67 U$1.J2 | v31.75,5.08 45.72,5.08 48.26,7.62 v52.07,7.62 | E13.8 86.36,16.51 E10.6 | v51.44,17.78 56.52,12.7 60.33,12.7 60.96,12.06 v60.96,10.16 | v44.45,30.48 46.99,27.94 50.17,27.94 v51.44,26.67
K1  (via drill 0.81)
  Top 0.406: E14.6 90.81,36.83 89.54,35.56 v79.38,35.56 78.74,35.56 77.47,36.83 E11.9 | U$4.K1 8.26,29.21 U$1.K1 | v68.58,27.3 65.41,24.13 E8.1
  Bottom 0.406: E5.6 55.25,36.83 56.52,38.1 65.41,38.1 66.68,36.83 E11.9 | 33.02,27.94 E2.2 | 33.02,27.94 21.59,27.94 20.32,29.21 U$4.K1 | E8.1 59.06,24.13 57.79,25.4 45.09,25.4 42.55,27.94 33.02,27.94 | v79.38,35.56 76.2,32.38 76.2,27.94 69.22,27.94 v68.58,27.3
K2  (via drill 0.81)
  Top 0.406: E11.1 85.09,20.32 87,20.32 90.81,24.13 E14.1 | 35.56,25.4 E4.8 | 35.56,25.4 35.56,29.21 E2.3 | E8.4 59.06,31.75 57.79,30.48 55.25,30.48 53.98,31.75 51.44,31.75 50.17,30.48 47.63,30.48 42.55,25.4 35.56,25.4 | v76.84,25.4 74.3,27.94 73.03,27.94 v71.76,29.21
  Bottom 0.406: E2.3 28.58,29.21 27.31,30.48 U$4.K2 17.15,30.48 16.51,29.84 8.26,29.84 U$1.K2 | E11.1 80.01,25.4 v76.84,25.4 | v71.76,29.21 69.22,31.75 E8.4
L1  (via drill 0.81)
  Top 0.406: E6.1 48.26,43.18 47.63,43.18 45.72,41.27 v45.72,40.64 | v69.85,33.02 v69.85,39.37 | v67.31,28.57 65.41,26.67 E8.2 | U$4.L1 8.26,32.38 U$1.L1
  Bottom 0.406: U$4.L1 25.4,32.38 26.04,33.02 33.02,33.02 E2.5 38.1,34.29 39.37,35.56 42.55,35.56 45.09,33.02 46.36,33.02 | E8.2 59.06,26.67 57.79,27.94 53.98,27.94 50.8,31.11 50.8,33.02 46.36,33.02 | v45.72,40.64 45.72,38.1 46.36,37.47 46.36,33.02 | v69.85,39.37 E11.8 | v69.85,33.02 64.14,33.02 63.5,32.38 63.5,30.48 65.41,30.48 v67.31,28.57
L2  (via drill 0.81)
  Top 0.406: v91.44,25.4 92.71,26.67 E14.2 | E11.2 v78.74,24.13 | v28.58,31.75 27.31,33.02 20.96,33.02 U$4.L2 | v54.61,34.29 53.34,35.56 43.18,35.56 E5.10
  Bottom 0.406: E11.2 82.55,25.4 v91.44,25.4 | E8.5 64.14,34.29 62.23,32.38 | 62.23,32.38 62.23,27.94 66.04,27.94 68.58,25.4 74.93,25.4 76.2,24.13 v78.74,24.13 | E5.10 40.01,34.29 38.74,33.02 35.56,33.02 E2.4 v28.58,31.75 | U$4.L2 15.24,33.66 14.61,33.02 8.26,33.02 U$1.L2 | 62.23,32.38 61.6,33.02 55.88,33.02 v54.61,34.29
M1  (via drill 0.81)
  Top 0.406: U$1.M1 8.26,35.56 U$4.M1 17.78,37.47 19.05,37.47 20.32,38.73 21.59,38.73 22.23,39.37 24.77,39.37 26.04,38.1 27.31,38.1 29.85,35.56 29.85,33.66 31.75,33.66 34.93,36.83 | v40.64,33.02 36.83,36.83 34.93,36.83 | E6.2 44.45,41.91 44.45,40.01 v43.82,40.01 | v97.79,25.4 97.79,20.32 94.62,20.32 92.08,17.78 80.65,17.78 80.01,18.41 80.01,20.32 80.65,20.32 81.28,20.95 81.28,22.86 v72.39,22.86 | 34.93,36.83 E2.6
  Bottom 0.406: E12.13 79.38,46.99 80.65,48.26 87.63,48.26 E15.12 92.71,45.72 97.16,45.72 97.79,45.09 97.79,43.18 94.62,43.18 93.98,42.55 93.98,25.4 v97.79,25.4 | v40.64,33.02 43.82,33.02 46.36,30.48 50.17,30.48 53.98,26.67 E8.13 57.79,26.67 59.06,25.4 65.41,25.4 66.68,24.13 71.12,24.13 v72.39,22.86 | v43.82,40.01 43.18,40.64 40.01,40.64 36.2,36.83 E2.6
M2  (via drill 0.81)
  Top 0.406: v91.44,29.21 E14.3 100.33,29.21 100.33,15.88 97.16,12.7 95.89,12.7 93.35,10.16 88.27,10.16 87,8.89 85.73,8.89 84.46,10.16 73.03,10.16 70.49,12.7 v66.68,12.7 | v47.63,36.83 E5.9 | v54.61,38.1 57.79,38.1 v59.06,36.83 | E11.4 77.47,35.56 v75.57,35.56 | E2.9 28.58,34.92 28.58,33.02 29.21,33.02 v31.75,30.48 | v46.36,26.67 46.36,19.05 v46.99,19.05 | v59.69,11.43 60.96,12.7 v62.23,12.7
  Bottom 0.406: E2.9 U$4.M2 15.24,36.83 14.61,36.2 8.26,36.2 U$1.M2 | v91.44,29.21 90.17,30.48 82.55,30.48 E11.4 | v47.63,36.83 48.9,38.1 v54.61,38.1 | v59.06,36.83 E8.6 65.41,36.83 66.68,35.56 v75.57,35.56 | v31.75,30.48 42.55,30.48 v46.36,26.67 | v46.99,19.05 46.99,13.97 47.63,13.97 48.9,12.7 53.98,12.7 56.52,10.16 58.42,10.16 v59.69,11.43 | v66.68,12.7 v62.23,12.7
N1  (via drill 0.81)
  Top 0.406: U$4.N1 8.26,38.73 U$1.N1 | v38.74,43.81 40.64,45.72 45.72,45.72 E6.3 | E8.12 57.79,28.57 62.23,28.57 64.14,30.48 v74.93,30.48 | v84.46,40.64 81.92,43.18 80.01,43.18 75.57,47.62 | E12.12 75.57,47.62 | v76.84,48.26 76.2,47.62 75.57,47.62 | v59.69,47.62 62.23,50.16 v62.23,50.8 | v25.4,35.56 v22.86,38.1 | v31.12,34.92 31.12,41.91 33.66,44.45 E3.1
  Bottom 0.406: E3.1 34.93,43.81 v38.74,43.81 | v74.93,30.48 74.93,34.29 76.2,34.29 80.01,38.1 81.92,38.1 v84.46,40.64 | E15.11 87.63,50.8 79.38,50.8 v76.84,48.26 | E6.3 50.8,48.26 59.06,48.26 v59.69,47.62 | v62.23,50.8 72.39,50.8 E12.12 | U$4.N1 18.42,38.1 v22.86,38.1 | v25.4,35.56 30.48,35.56 v31.12,34.92
N2  (via drill 0.81)
  Top 0.406: v54.61,22.86 v54.61,29.21 | v85.73,21.59 85.73,28.57 86.36,28.57 88.27,30.48 95.25,30.48 E14.4 | v95.25,35.56 v91.44,35.56 | v87,40.64 81.92,45.72 80.65,45.72 78.11,48.26 78.11,50.8 67.95,50.8 65.41,53.34 v62.23,53.34 | v46.36,55.88 46.36,52.7 45.09,52.7 43.18,50.8 41.28,50.8 36.2,45.72 v36.2,40.64
  Bottom 0.406: v54.61,29.21 E8.11 | v54.61,22.86 57.15,20.32 78.11,20.32 80.65,17.78 81.92,17.78 v85.73,21.59 | E11.5 82.55,35.56 90.17,35.56 | v91.44,35.56 90.17,35.56 | v95.25,35.56 95.25,31.75 E14.4 | E5.8 38.1,35.56 32.39,35.56 29.85,38.1 | 29.85,38.1 28.58,39.37 E2.8 20.96,39.37 U$4.N2 15.24,40.01 14.61,39.37 8.26,39.37 U$1.N2 | 90.17,35.56 90.17,40.64 v87,40.64 | v62.23,53.34 54.61,53.34 53.34,54.61 51.44,54.61 50.17,55.88 v46.36,55.88 | v36.2,40.64 36.2,38.1 29.85,38.1
P1  (via drill 0.81)
  Top 0.406: E6.4 46.99,52.07 v44.45,49.53 | v99.06,45.09 99.06,33.02 v91.44,33.02 | v77.47,31.75 76.2,33.02 73.03,33.02 71.12,34.92 71.12,40.64 67.95,43.81 67.95,45.72 66.04,45.72 E9.1 | U$4.P1 8.26,41.91 U$1.P1
  Bottom 0.406: E12.10 79.38,54.61 80.65,55.88 95.25,55.88 E15.5 99.06,52.07 v99.06,45.09 | U$4.P1 22.23,41.91 26.04,45.72 29.21,45.72 30.48,46.99 E3.2 38.74,46.99 40.01,45.72 44.45,45.72 | 44.45,45.72 v44.45,49.53 | E9.1 59.06,44.45 57.79,45.72 44.45,45.72 | v91.44,33.02 78.74,33.02 v77.47,31.75
P2  (via drill 0.81)
  Top 0.406: E8.10 60.33,34.29 64.14,38.1 66.04,38.1 v67.31,39.37 | E14.8 83.82,39.37 82.55,40.64 v78.74,40.64 78.74,43.18 76.2,45.72 v71.12,45.72 | E3.3 30.48,45.72 v24.13,45.72 | v59.06,49.53 57.79,50.8 47.63,50.8 43.82,46.99 E6.13
  Bottom 0.406: v67.31,39.37 68.58,40.64 v78.74,40.64 | E11.6 86.36,36.83 E14.8 | E6.13 40.64,48.26 38.74,48.26 37.47,49.53 E3.3 | U$1.P2 8.26,42.55 14.61,42.55 15.24,43.18 U$4.P2 21.59,43.18 v24.13,45.72 | v71.12,45.72 62.87,45.72 60.96,47.62 60.96,48.9 59.69,48.9 v59.06,49.53
R1  (via drill 0.81)
  Top 0.406: U$4.R1 8.26,45.09 U$1.R1 | E15.6 92.71,53.34 77.47,53.34 E12.9 71.12,54.61 v69.85,54.61 | E9.2 63.5,48.26 63.5,52.07 v60.96,52.07 59.06,52.07 57.79,53.34 50.8,53.34 E6.5 | v24.13,47.62 24.77,48.26 27.94,48.26 E3.5
  Bottom 0.406: E3.5 35.56,55.88 44.45,55.88 45.72,54.61 E6.5 | v69.85,54.61 68.58,53.34 64.14,53.34 62.87,52.07 v60.96,52.07 | U$4.R1 21.59,45.09 v24.13,47.62
R2  (via drill 0.81)
  Top 0.406: v37.47,50.8 36.2,52.07 35.56,52.07 | E3.4 35.56,52.07 | E6.12 38.1,45.72 37.47,45.72 37.47,41.91 41.28,38.1 50.17,38.1 51.44,36.83 E8.9 58.42,35.56 60.33,35.56 60.33,36.83 v65.41,41.91 | v73.03,41.91 v75.57,44.45 | U$4.R2 26.04,40.64 28.58,40.64 33.66,45.72 34.93,45.72 35.56,46.35 35.56,52.07
  Bottom 0.406: U$4.R2 15.24,46.35 14.61,45.72 8.26,45.72 U$1.R2 | E15.1 92.71,44.45 91.44,45.72 82.55,45.72 E12.1 v75.57,44.45 | E6.12 38.74,49.53 v37.47,50.8 | v65.41,41.91 v73.03,41.91
S1  (via drill 0.81)
  Top 0.406: E6.6 48.9,57.15 47.63,58.42 35.56,58.42 E3.6 v29.21,52.07 | v66.68,59.69 65.41,58.42 64.14,58.42 v62.87,57.15 | E9.13 50.8,40.64 48.26,40.64 v47.63,40.01 | v28.58,44.45 27.31,43.18 24.77,43.18 21.59,46.35 v21.59,48.26 22.23,48.26 v22.23,50.8 | U$4.S1 8.26,48.26 U$1.S1
  Bottom 0.406: v66.68,59.69 E12.8 | v62.87,57.15 59.06,57.15 57.79,55.88 51.44,55.88 50.17,57.15 E6.6 | v47.63,40.01 47.63,40.64 45.09,43.18 41.28,43.18 38.74,45.72 30.48,45.72 29.21,44.45 v28.58,44.45 | U$4.S1 v21.59,48.26 | v29.21,52.07 27.94,50.8 v22.23,50.8
S2  (via drill 0.81)
  Top 0.406: E8.8 58.42,40.64 60.33,40.64 62.87,43.18 65.41,43.18 v66.68,44.45 | E15.2 95.25,45.72 83.19,45.72 81.92,46.99 E12.2 79.38,48.9 79.38,52.07 75.57,52.07 74.3,53.34 v71.12,53.34 | v36.83,48.26 40.64,52.07 E6.11 43.18,52.07 43.18,54.61 45.72,57.15 46.99,57.15 48.26,55.88 v59.69,55.88
  Bottom 0.406: v66.68,44.45 71.76,44.45 73.03,45.72 80.01,45.72 E12.2 | 25.4,48.26 24.13,49.53 U$4.S2 15.24,49.53 14.61,48.9 8.26,48.9 U$1.S2 | 25.4,48.26 E3.13 | 25.4,48.26 v36.83,48.26 | v71.12,53.34 71.12,55.88 v59.69,55.88
T2
  Top 0.406: E15.3 93.98,46.99 90.81,46.99 89.54,48.26 85.09,48.26 E12.4 | U$4.T2 20.96,52.07 23.5,52.07 26.04,49.53 E3.12
  Bottom 0.406: U$4.T2 15.24,52.7 14.61,52.07 8.26,52.07 U$1.T2 | E3.12 32.39,49.53 33.66,50.8 35.56,50.8 39.37,54.61 E6.10 43.18,53.34 53.34,53.34 55.88,50.8 60.33,50.8 61.6,49.53 E9.3 71.76,49.53 73.03,48.26 74.93,48.26 78.74,52.07 E12.4
U1  (via drill 0.81)
  Top 0.406: v36.83,53.98 v38.74,52.07 | U$4.U1 8.26,54.61 U$1.U1 | R1.2 97.79,48.26 97.79,43.18 v92.71,43.18 | v91.44,38.1 76.84,38.1 74.3,40.64 72.39,40.64 69.22,43.81 v69.22,46.99 | v62.23,48.26 60.33,46.35 59.06,46.35 58.42,46.99 58.42,48.26 E9.12
  Bottom 0.406: R1.2 R2.1 | U$4.U1 E3.10 27.94,53.34 36.2,53.34 v36.83,53.98 | E9.12 51.44,49.53 50.17,50.8 40.01,50.8 v38.74,52.07 | v92.71,43.18 92.71,38.1 v91.44,38.1 | v69.22,46.99 67.95,48.26 v62.23,48.26
U2  (via drill 0.81)
  Top 0.406: E3.9 23.5,57.15 22.23,55.88 U$4.U2 | v79.38,56.52 E12.5
  Bottom 0.406: E9.4 71.76,52.07 73.03,53.34 80.01,53.34 | E12.5 80.01,53.34 | E15.4 95.25,53.34 80.01,53.34 | E3.9 27.94,58.42 40.01,58.42 41.28,57.15 E6.9 45.09,57.15 46.36,58.42 77.47,58.42 v79.38,56.52 | U$4.U2 16.51,55.88 15.88,55.24 8.26,55.24 U$1.U2
V1  (via drill 0.81)
  Top 0.406: E9.6 66.04,57.15 68.58,59.69 | 68.58,59.69 69.85,60.96 100.33,60.96 R3.2 | v29.21,54.61 E3.11 | U$1.V1 8.26,57.78 U$4.V1 18.42,58.42 19.05,58.42 19.05,59.69 20.32,60.96 67.31,60.96 68.58,59.69
  Bottom 0.406: R3.2 R4.1 | v29.21,54.61 27.94,55.88 22.23,55.88 20.32,57.78 U$4.V1
V2  (via drill 0.81)
  Top 0.406: E6.8 47.63,59.69 48.9,58.42 59.06,58.42 61.6,55.88 63.5,55.88 E9.5 68.58,58.42 74.3,58.42 v75.57,59.69 | v15.24,56.52 18.42,56.52 20.32,58.42 U$4.V2
  Bottom 0.406: E15.8 83.82,59.69 E12.6 78.74,59.69 v75.57,59.69 | U$4.V2 20.96,59.69 E3.8 27.94,60.96 40.64,60.96 E6.8 | v15.24,56.52 15.24,57.15 14.61,57.78 8.26,57.78 U$1.V2
VCC  (via drill 0.81)
  Top 0.406: C13.1 90.17,3.81 E13.14 | C4.1 43.18,3.81 E4.14 | C7.1 58.42,3.81 E7.14 | C6.1 43.18,44.45 E6.14 | C15.1 92.71,41.91 92.71,41.27 93.35,40.64 v97.79,40.64 v97.79,35.56
  Bottom 0.406: 73.66,2.54 73.66,1.27 C10.1 | 73.66,2.54 E10.14 | 73.66,2.54 87.63,2.54 E13.14 93.98,3.81 93.98,4.45 94.62,5.08 97.16,5.08 97.79,5.71 97.79,17.14 97.16,17.78 92.71,17.78 92.71,20.95 92.08,21.59 C14.1 88.9,21.59 88.9,22.86 | 27.94,2.54 C1.1 | 27.94,2.54 E1.14 21.59,3.81 U$4.A2 17.15,5.08 16.51,4.45 8.26,4.45 U$1.A2 | 27.94,2.54 40.64,2.54 E4.14 45.09,3.81 46.36,2.54 55.88,2.54 E7.14 59.06,3.81 60.33,2.54 73.66,2.54 | 73.66,43.18 E12.14 | 73.66,43.18 C12.1 76.2,43.18 88.9,43.18 | 88.9,43.18 E15.14 | C15.1 88.9,43.18 | 27.94,43.18 C3.1 | E3.14 27.94,43.18 | C6.1 34.93,41.91 33.66,43.18 27.94,43.18 | 58.42,43.18 58.42,43.81 57.79,43.81 E9.14 | 58.42,43.18 C9.1 | E6.14 47.63,44.45 48.9,43.18 58.42,43.18 | 58.42,43.18 73.66,43.18 | 58.42,22.86 58.42,23.5 57.79,23.5 E8.14 51.44,24.13 50.17,22.86 43.18,22.86 | 58.42,22.86 C8.1 | 27.94,22.86 27.94,24.13 E2.14 | 27.94,22.86 C2.1 | 43.18,22.86 43.18,24.13 E5.14 | 43.18,22.86 C5.1 | 43.18,22.86 27.94,22.86 | 58.42,22.86 70.49,22.86 71.76,21.59 C11.1 75.57,21.59 75.57,22.86 | R4.2 111.13,57.15 111.13,55.24 R2.2 112.4,54.61 113.03,53.98 113.03,40.64 v97.79,40.64 | E11.14 74.93,24.13 75.57,23.5 75.57,22.86 | 88.9,22.86 E14.14 | 88.9,22.86 75.57,22.86 | v97.79,35.56 98.43,35.56 99.06,34.92 99.06,22.86 88.9,22.86

### Text on the board
Bottom: VRS | M111/M113/M115/M117/M119 Replacement
tNames: M111 | M113 | M115 | M117 | M119 | Fill Only One Row. | M113/M117/M119: Use Resistors. | M111/M115: Remove Resistors. | M111/M113/M115/M117/M119 Replacement